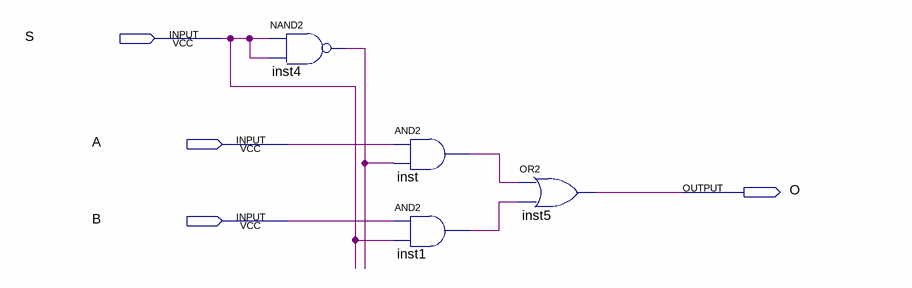
[diagram p0: schematic sheet]
// Quartus schematic multiplexer_1b_2w.bdf as structural Verilog: 4 symbols, 4 pins
module multiplexer_1b_2w (
  input  S,
  input  A,
  input  B,
  output O
);

  wire inst1_out, inst4_out, inst_out;

  nand inst4 (inst4_out, S, S);
  and inst (inst_out, A, inst4_out);
  and inst1 (inst1_out, B, S);
  or inst5 (O, inst_out, inst1_out);
endmodule
